# Altium schematic sheet CW308T_STM32FSOCKET_Micro.SchDoc: STM32F UFO Target
size Letter; Organization: NewAE Technology Inc.; Address1: 1083 Queen St., Suite 196; Address2: Halifax; Address3: NS; Address4: Canada B3H 0B2; DocumentNumber: .; Revision: .; SheetNumber: 1; SheetTotal: 1; SheetApproved: YES
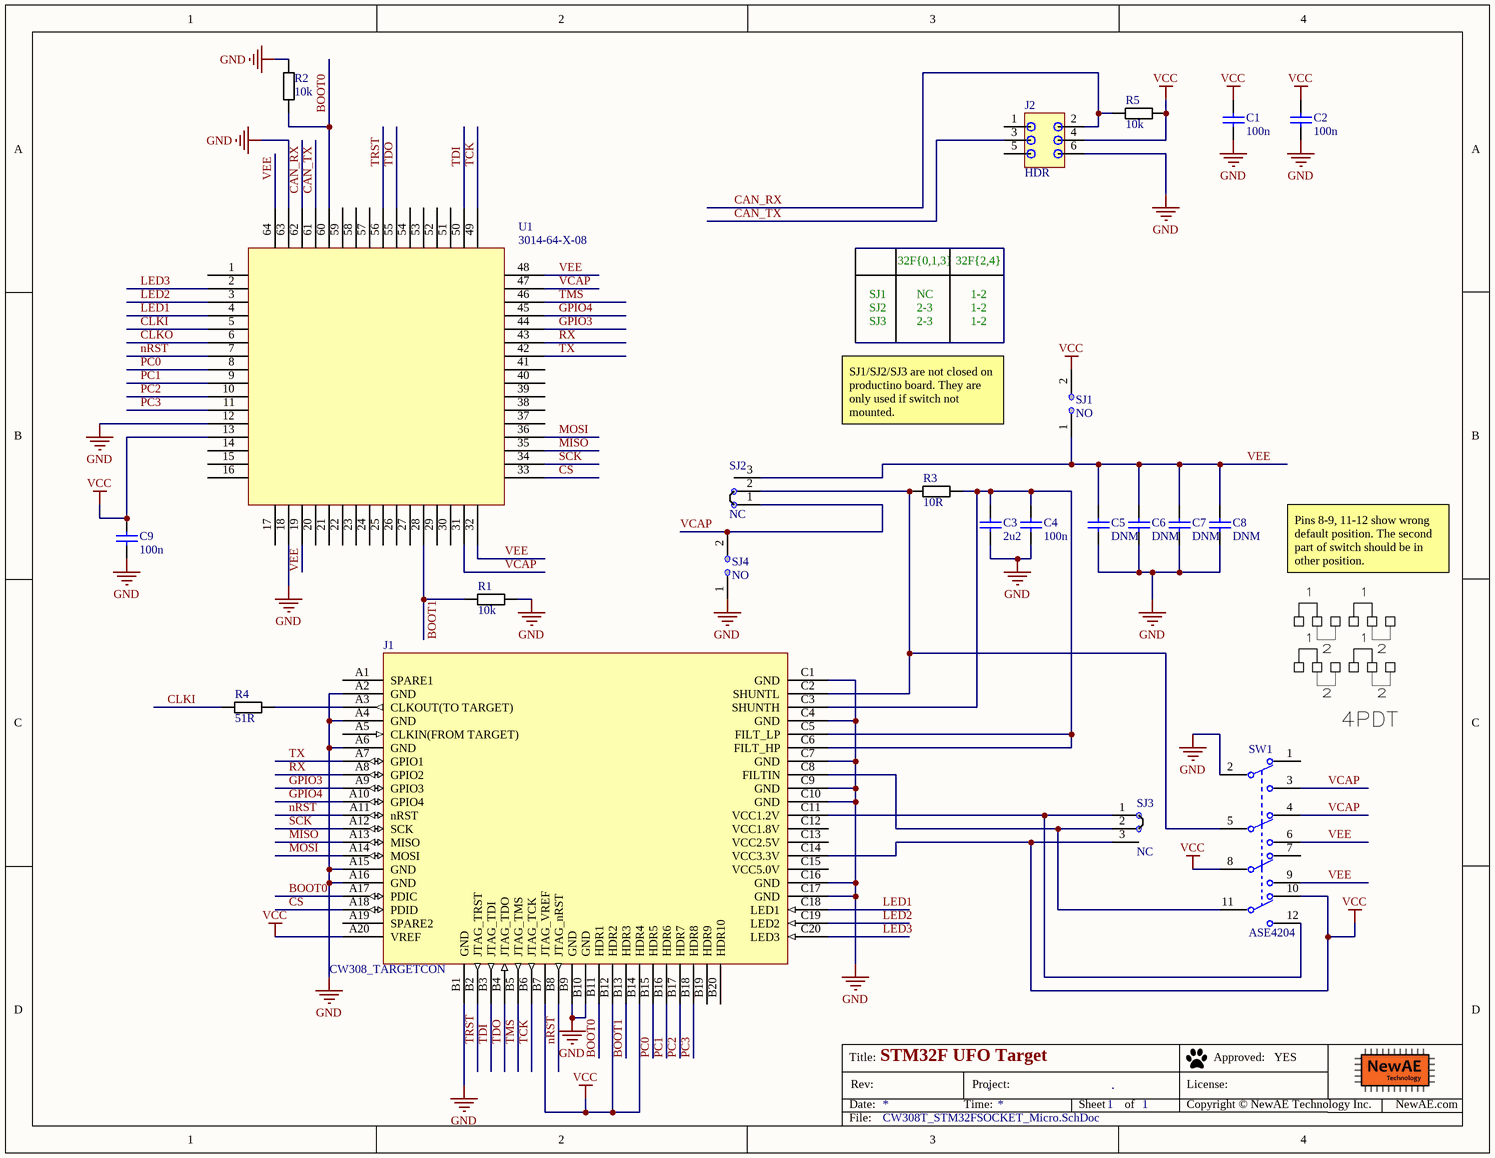
[diagram p0: CW308T_STM32FSOCKET_Micro.SchDoc]

## Parts
C1  100n  [CAPC0603_M]
C2  100n  [CAPC0603_M]
C3  2u2  [CAPC0603_M]
C4  100n  [CAPC0603_M]
C5  DNM  [CAPC0603_M]
C6  DNM  [CAPC0603_M]
C7  DNM  [CAPC0603_M]
C8  DNM  [CAPC0603_M]
C9  100n  [CAPC0603_M]
J1  CW308_TARGETCON  [CW308_TBOARD_CONN]
J2  HDR  [HDR_6PIN_2ROW_SHROUD]
R1  10k  [RESC1608X55N]
R2  10k  [RESC1608X55N]
R3  10R  [RESC1608X55N]
R4  51R  [RESC1608X55N]
R5  10k  [RESC1608X55N]
SJ1  NO  [SJ_2S_NO]  (no BOM)
SJ2  NC  [SJ_3S_NC12]  (no BOM)
SJ3  NC  [SJ_3S_NC12]  (no BOM)
SJ4  NO  [SJ_2S_NO]  (no BOM)
SW1  ASE4204  [FP-ASE4204-MFG]
U1  3014-64-X-08  [3014-64-X-08]

## Nets
GND: C1.2 C2.2 C3.2 C4.2 C5.2 C6.2 C7.2 C8.2 C9.2 J1.A2(GND) J1.A4(GND) J1.A6(GND) J1.A15(GND) J1.A16(GND) J1.B1(GND) J1.B9(GND) J1.B10(GND) J1.C1(GND) J1.C4(GND) J1.C7(GND) J1.C9(GND) J1.C10(GND) J1.C16(GND) J1.C17(GND) J2.6 R1.2 R2.2 SJ4.1 SW1.2 U1.12 U1.18 U1.63
VCC: C1.1 C2.1 C9.1 J1.A20(VREF) J1.B7(JTAG_VREF) J1.B12(HDR2) J1.B14(HDR4) J1.C14(VCC3.3V) J2.4 R5.2 SJ1.2 SJ3.3 SW1.8 SW1.10 U1.13
BOOT0: J1.A17(PDIC) J1.B11(HDR1) R2.1 U1.60
BOOT1: J1.B13(HDR3) R1.1 U1.28
CAN_RX: J2.2 R5.1 U1.62
CAN_TX: J2.3 U1.61
CLKI: R4.1 U1.5
CLKO: U1.6
CS: J1.A18(PDID) U1.33
GPIO3: J1.A9(GPIO3) U1.44
GPIO4: J1.A10(GPIO4) U1.45
LED1: J1.C18(LED1) U1.4
LED2: J1.C19(LED2) U1.3
LED3: J1.C20(LED3) U1.2
MISO: J1.A13(MISO) U1.35
MOSI: J1.A14(MOSI) U1.36
nRST: J1.A11(nRST) J1.B8(JTAG_nRST) U1.7
PC0: J1.B15(HDR5) U1.8
PC1: J1.B16(HDR6) U1.9
PC2: J1.B17(HDR7) U1.10
PC3: J1.B18(HDR8) U1.11
RX: J1.A8(GPIO2) U1.43
SCK: J1.A12(SCK) U1.34
TCK: J1.B6(JTAG_TCK) U1.49
TDI: J1.B3(JTAG_TDI) U1.50
TDO: J1.B4(JTAG_TDO) U1.55
TMS: J1.B5(JTAG_TMS) U1.46
TRST: J1.B2(JTAG_TRST) U1.56
TX: J1.A7(GPIO1) U1.42
VCAP: SJ2.1 SJ4.2 SW1.3 SW1.4 U1.31 U1.47
VEE: C5.1 C6.1 C7.1 C8.1 SJ1.1 SJ2.3 SW1.6 SW1.9 U1.19 U1.32 U1.48 U1.64
NetC3_1: C3.1 C4.1 J1.C3(SHUNTH) J1.C5(FILT_LP) J1.C6(FILT_HP) R3.2
NetJ1_A3: J1.A3(CLKOUT(TO_TARGET)) R4.2
NetJ1_C2: J1.C2(SHUNTL) R3.1 SJ2.2 SW1.5
NetJ1_C8: J1.C8(FILTIN) SJ3.2 SW1.11
NetJ1_C11: J1.C11(VCC1.2V) SJ3.1 SW1.12

Not connected (* = marked no-connect by the designer): J1 A1(SPARE1) A5(CLKIN(FROM_TARGET)) A19(SPARE2) B19(HDR9) B20(HDR10) C12(VCC1.8V) C13(VCC2.5V) C15(VCC5.0V); J2 1 5; SW1 1 7; U1 1 14 15 16 17 20 21 22 23 24 25 26 27 29 30 37 38 39 40 41 51 52 53 54 57 58 59

## Notes on the sheet
- SJ1
- 32F{0,1,3}
- NC
- 32F{2,4}
- 1-2
- SJ2
- SJ3
- 2-3
- SJ1/SJ2/SJ3 are not closed on productino board. They are only used if switch not mounted.
- Pins 8-9, 11-12 show wrong default position. The second part of switch should be in other position.
- Title:
- Date:
- Rev:
- Time:
- Project:
- Sheet
- of
- License:
- Copyright © NewAE Technology Inc.
- Approved:
- NewAE.com
- File:

## Library data of the parts
C1 C2 C4 C9 = CCHIP-100n-0603: 100n, 0603; Component Group: Capacitor; Case-EIA: 0603; Case-Metric: 1608; Part Number: CCHIP-100n-0603; Footprint: 0603; Pin Count: 2; Value: 100n; Mounting Technology: SMT; Component Kind: Standard; Component Type: Standard
C3 = CCHIP-2u2-0603: 2u2, 0603; Component Group: Capacitor; Case-EIA: 0603; Case-Metric: 1608; Part Number: CCHIP-2u2-0603; Footprint: 0603; Pin Count: 2; Value: 2u2; Mounting Technology: SMT; Component Kind: Standard; Component Type: Standard
C5-C8 = CCHIP-DNM-0603: DNM, 0603; Component Group: Capacitor; Case-EIA: 0603; Part Number: CCHIP-DNM-0603; Footprint: 0603; Pin Count: 2; Value: DNM; Mounting Technology: SMT; Component Kind: Standard; Component Type: Standard
J1 = CW308_TBOARD: CW308 "Standard" Target Board Connector; Component Group: Mechanical; Pitch: 2.54mm; Part Number: CW308_TBOARD; Pin Count: 60; Mounting Technology: Through-hole; Component Kind: Standard; Component Type: Standard
J2 = HDR_6PIN_2ROW_SHROUD: HDR, Male, 6-Pin, 2 Row, Shrouded; Manufacture 1: FCI Connectors; Manufacture Part Number 1: 75869-131LF; Component Group: Connector; Part Number: HDR_6PIN_2ROW_SHROUD; Pin Count: 6; Supplier 1: Digi-Key; Supplier Part Number 1: 609-2845-ND; Mounting Technology: Through-hole; RoHS: Yes; Component Kind: Standard; Component Type: Standard
R1 R2 R5 = RCHIP-10K-0603: 10k res, 0603, 1%, 1/10W; Manufacture 1: Yageo; Manufacture Part Number 1: RC0603FR-0710KL; Component Group: Resistor; Case-EIA: 0603; Case-Metric: 1608; Rated Power: 0.1W; Rated Voltage: 75VDC; Part Number: RCHIP-10K-0603; Footprint: 0603; Pin Count: 2; Supplier 1: Digi-Key; Supplier Part Number 1: 311-10.0KHRCT-ND; Value: 10k; Tolerance: 1%; Mounting Technology: SMT; Temperature Range: -55C to 155C; Component Kind: Standard; Component Type: Standard
R3 = RCHIP-10R-0603: 10R res, 0603, 1%, 1/10W; Manufacture 1: Yageo; Manufacture Part Number 1: RC0603FR-0710RL; Component Group: Resistor; Case-EIA: 0603; Case-Metric: 1608; Rated Power: 0.1W; Rated Voltage: 75VDC; Part Number: RCHIP-10R-0603; Footprint: 0603; Pin Count: 2; Supplier 1: Digi-Key; Supplier Part Number 1: 311-10.0HRCT-ND; Value: 10R; Tolerance: 1%; Mounting Technology: SMT; Temperature Range: -55C to 155C; Component Kind: Standard; Component Type: Standard
R4 = RCHIP-100R-0603: 100R res, 0603, 1%, 1/10W; Manufacture 1: Yageo; Manufacture Part Number 1: RC0603FR-07100RL; Component Group: Resistor; Case-EIA: 0603; Case-Metric: 1608; Rated Power: 0.1W; Rated Voltage: 75VDC; Part Number: RCHIP-100R-0603; Footprint: 0603; Pin Count: 2; Supplier 1: Digi-Key; Supplier Part Number 1: 311-100HRCT-ND; Value: 100R; Tolerance: 1%; Mounting Technology: SMT; Temperature Range: -55C to 155C; Component Kind: Standard; Component Type: Standard
SJ1 SJ4 = SJ_2S_NO: Solder Jumper, NO; Component Group: PCB Feature; Part Number: SJ_2S_NO; Pin Count: 2; Mounting Technology: COPPER; Component Type: Standard (No BOM)
SJ2 SJ3 = SJ_3S_12JMP: Solder Jumper, NC; Component Group: PCB Feature; Part Number: SJ_3S_12JMP; Pin Count: 3; Mounting Technology: COPPER; Component Type: Standard (No BOM)
SW1 = CMP-03405-000007-1: Pushbutton Switch SPST-NO Keyswitch, Illuminated Through Hole; Actuator Type: SLIDE; Contact Current Rating: 300mA; Actuator Color: Natural; Throw Configuration: 4PDT; Actuator Material: Polyester; Max Voltage Rating (DC): 115V; Number of Positions: 2; Electrical Life: 15000Cycles; Number of Poles: 4; Contact Resistance: 40mR; REACH SVHC: No SVHC; Min Operating Temperature: -40°C; Current Rating: 300mA; Flammability Rating: UL94 V-0; Termination: Solder; RoHS Compliant: Yes; Contact Plating: Silver; Contact Material: Copper Alloy; Orientation: Vertical; Max Operating Temperature: 80°C; Packaging: Rail/Tube; Mount: Through Hole; Color: Natural; Voltage Rating (AC): 115V; Lead Free: Lead Free
U1 = TQFP64_SOCKET